# Altium project StigmatorDriver.PrjPcb
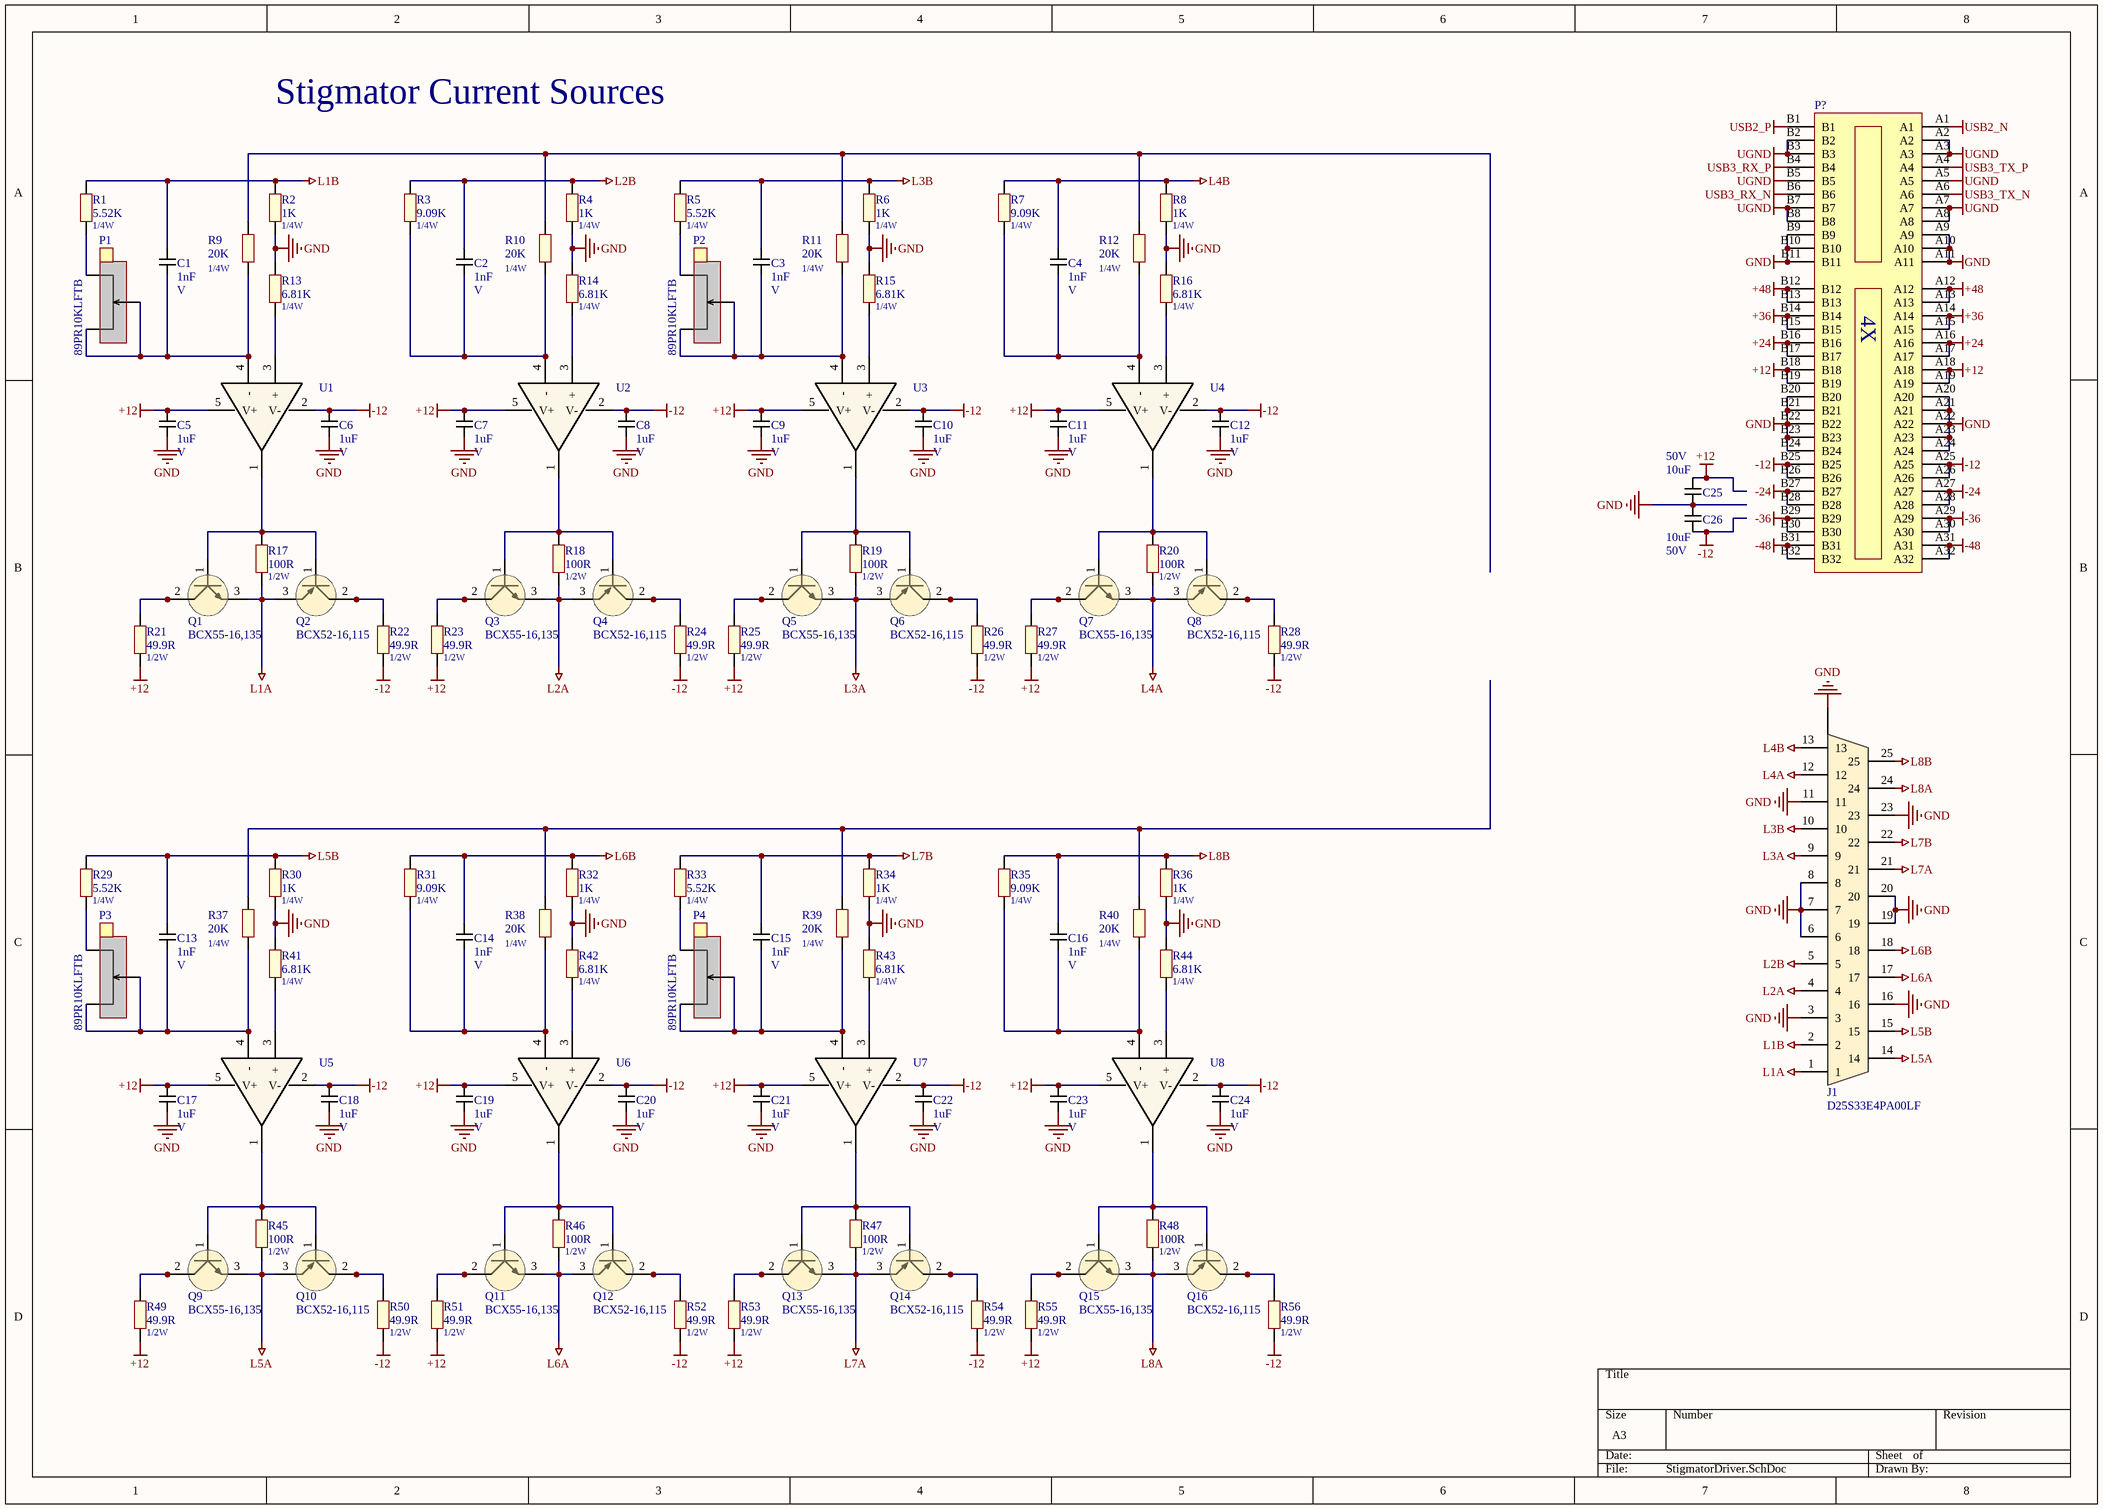
[diagram p0: StigmatorDriver.SchDoc]
1 sheet, 112 parts. Net scope: global (net labels, ports and power ports of the same name join across sheets).
Board file: SigmatorDriver.PcbDoc

## Sheet StigmatorDriver.SchDoc
size A3; SheetNumber: 1; SheetTotal: 1

### Parts
C1  1nF  Voltage: V  [C1206]
C2  1nF  Voltage: V  [C1206]
C3  1nF  Voltage: V  [C1206]
C4  1nF  Voltage: V  [C1206]
C5  1uF  Voltage: V  [C1206]
C6  1uF  Voltage: V  [C1206]
C7  1uF  Voltage: V  [C1206]
C8  1uF  Voltage: V  [C1206]
C9  1uF  Voltage: V  [C1206]
C10  1uF  Voltage: V  [C1206]
C11  1uF  Voltage: V  [C1206]
C12  1uF  Voltage: V  [C1206]
C13  1nF  Voltage: V  [C1206]
C14  1nF  Voltage: V  [C1206]
C15  1nF  Voltage: V  [C1206]
C16  1nF  Voltage: V  [C1206]
C17  1uF  Voltage: V  [C1206]
C18  1uF  Voltage: V  [C1206]
C19  1uF  Voltage: V  [C1206]
C20  1uF  Voltage: V  [C1206]
C21  1uF  Voltage: V  [C1206]
C22  1uF  Voltage: V  [C1206]
C23  1uF  Voltage: V  [C1206]
C24  1uF  Voltage: V  [C1206]
C25  10uF  Voltage: 50V  [C2220]
C26  10uF  Voltage: 50V  [C2220]
J1  D25S33E4PA00LF  [D25S33E4PA00LF]
P1  89PR10KLFTB  [89PR10KLFTB]
P2  89PR10KLFTB  [89PR10KLFTB]
P3  89PR10KLFTB  [89PR10KLFTB]
P4  89PR10KLFTB  [89PR10KLFTB]
P?  10018783-10201TLF  [PCIe4X]  (value not drawn)
Q1  BCX55-16,135  [SOT-89-3]
Q2  BCX52-16,115  [SOT-89-3]
Q3  BCX55-16,135  [SOT-89-3]
Q4  BCX52-16,115  [SOT-89-3]
Q5  BCX55-16,135  [SOT-89-3]
Q6  BCX52-16,115  [SOT-89-3]
Q7  BCX55-16,135  [SOT-89-3]
Q8  BCX52-16,115  [SOT-89-3]
Q9  BCX55-16,135  [SOT-89-3]
Q10  BCX52-16,115  [SOT-89-3]
Q11  BCX55-16,135  [SOT-89-3]
Q12  BCX52-16,115  [SOT-89-3]
Q13  BCX55-16,135  [SOT-89-3]
Q14  BCX52-16,115  [SOT-89-3]
Q15  BCX55-16,135  [SOT-89-3]
Q16  BCX52-16,115  [SOT-89-3]
R1  5.52K  Power: 1/4W  [R0805]
R2  1K  Power: 1/4W  [R0805]
R3  9.09K  Power: 1/4W  [R0805]
R4  1K  Power: 1/4W  [R0805]
R5  5.52K  Power: 1/4W  [R0805]
R6  1K  Power: 1/4W  [R0805]
R7  9.09K  Power: 1/4W  [R0805]
R8  1K  Power: 1/4W  [R0805]
R9  20K  Power: 1/4W  [R0805]
R10  20K  Power: 1/4W  [R0805]
R11  20K  Power: 1/4W  [R0805]
R12  20K  Power: 1/4W  [R0805]
R13  6.81K  Power: 1/4W  [R0805]
R14  6.81K  Power: 1/4W  [R0805]
R15  6.81K  Power: 1/4W  [R0805]
R16  6.81K  Power: 1/4W  [R0805]
R17  100R  Power: 1/2W  [R1206]
R18  100R  Power: 1/2W  [R1206]
R19  100R  Power: 1/2W  [R1206]
R20  100R  Power: 1/2W  [R1206]
R21  49.9R  Power: 1/2W  [R1206]
R22  49.9R  Power: 1/2W  [R1206]
R23  49.9R  Power: 1/2W  [R1206]
R24  49.9R  Power: 1/2W  [R1206]
R25  49.9R  Power: 1/2W  [R1206]
R26  49.9R  Power: 1/2W  [R1206]
R27  49.9R  Power: 1/2W  [R1206]
R28  49.9R  Power: 1/2W  [R1206]
R29  5.52K  Power: 1/4W  [R0805]
R30  1K  Power: 1/4W  [R0805]
R31  9.09K  Power: 1/4W  [R0805]
R32  1K  Power: 1/4W  [R0805]
R33  5.52K  Power: 1/4W  [R0805]
R34  1K  Power: 1/4W  [R0805]
R35  9.09K  Power: 1/4W  [R0805]
R36  1K  Power: 1/4W  [R0805]
R37  20K  Power: 1/4W  [R0805]
R38  20K  Power: 1/4W  [R0805]
R39  20K  Power: 1/4W  [R0805]
R40  20K  Power: 1/4W  [R0805]
R41  6.81K  Power: 1/4W  [R0805]
R42  6.81K  Power: 1/4W  [R0805]
R43  6.81K  Power: 1/4W  [R0805]
R44  6.81K  Power: 1/4W  [R0805]
R45  100R  Power: 1/2W  [R1206]
R46  100R  Power: 1/2W  [R1206]
R47  100R  Power: 1/2W  [R1206]
R48  100R  Power: 1/2W  [R1206]
R49  49.9R  Power: 1/2W  [R1206]
R50  49.9R  Power: 1/2W  [R1206]
R51  49.9R  Power: 1/2W  [R1206]
R52  49.9R  Power: 1/2W  [R1206]
R53  49.9R  Power: 1/2W  [R1206]
R54  49.9R  Power: 1/2W  [R1206]
R55  49.9R  Power: 1/2W  [R1206]
R56  49.9R  Power: 1/2W  [R1206]
U1  TLV9361IDBVR  [SOT-23-5]  (value not drawn)
U2  TLV9361IDBVR  [SOT-23-5]  (value not drawn)
U3  TLV9361IDBVR  [SOT-23-5]  (value not drawn)
U4  TLV9361IDBVR  [SOT-23-5]  (value not drawn)
U5  TLV9361IDBVR  [SOT-23-5]  (value not drawn)
U6  TLV9361IDBVR  [SOT-23-5]  (value not drawn)
U7  TLV9361IDBVR  [SOT-23-5]  (value not drawn)
U8  TLV9361IDBVR  [SOT-23-5]  (value not drawn)

### Nets
+12: C5.2 C7.2 C9.2 C11.2 C17.2 C19.2 C21.2 C23.2 C25.2 P?.A18 P?.A19 P?.B18 P?.B19 R21.2 R23.2 R25.2 R27.2 R49.2 R51.2 R53.2 R55.2 U1.5(V+) U2.5(V+) U3.5(V+) U4.5(V+) U5.5(V+) U6.5(V+) U7.5(V+) U8.5(V+)
+24: P?.A16 P?.A17 P?.B16 P?.B17
+36: P?.A14 P?.A15 P?.B14 P?.B15
+48: P?.A12 P?.A13 P?.B12 P?.B13
-12: C6.2 C8.2 C10.2 C12.2 C18.2 C20.2 C22.2 C24.2 C26.1 P?.A25 P?.A26 P?.B25 P?.B26 R22.1 R24.1 R26.1 R28.1 R50.1 R52.1 R54.1 R56.1 U1.2(V-) U2.2(V-) U3.2(V-) U4.2(V-) U5.2(V-) U6.2(V-) U7.2(V-) U8.2(V-)
-24: P?.A27 P?.A28 P?.B27 P?.B28
-36: P?.A29 P?.A30 P?.B29 P?.B30
-48: P?.A31 P?.A32 P?.B31 P?.B32
GND: C5.1 C6.1 C7.1 C8.1 C9.1 C10.1 C11.1 C12.1 C17.1 C18.1 C19.1 C20.1 C21.1 C22.1 C23.1 C24.1 C25.1 C26.2 J1.3 J1.6 J1.7 J1.8 J1.11 J1.16 J1.19 J1.20 J1.23 J1.S P?.A9 P?.A10 P?.A11 P?.A20 P?.A21 P?.A22 P?.A23 P?.A24 P?.B9 P?.B10 P?.B11 P?.B20 P?.B21 P?.B22 P?.B23 P?.B24 R2.1 R4.1 R6.1 R8.1 R13.2 R14.2 R15.2 R16.2 R30.1 R32.1 R34.1 R36.1 R41.2 R42.2 R43.2 R44.2
L1A: J1.1 Q1.3 Q2.3 R17.1
L1B: C1.2 J1.2 R1.2 R2.2
L2A: J1.4 Q3.3 Q4.3 R18.1
L2B: C2.2 J1.5 R3.2 R4.2
L3A: J1.9 Q5.3 Q6.3 R19.1
L3B: C3.2 J1.10 R5.2 R6.2
L4A: J1.12 Q7.3 Q8.3 R20.1
L4B: C4.2 J1.13 R7.2 R8.2
L5A: J1.14 Q9.3 Q10.3 R45.1
L5B: C13.2 J1.15 R29.2 R30.2
L6A: J1.17 Q11.3 Q12.3 R46.1
L6B: C14.2 J1.18 R31.2 R32.2
L7A: J1.21 Q13.3 Q14.3 R47.1
L7B: C15.2 J1.22 R33.2 R34.2
L8A: J1.24 Q15.3 Q16.3 R48.1
L8B: C16.2 J1.25 R35.2 R36.2
UGND: P?.A2 P?.A3 P?.A5 P?.A7 P?.A8 P?.B2 P?.B3 P?.B5 P?.B7 P?.B8
USB2_N: P?.A1
USB2_P: P?.B1
USB3_RX_N: P?.B6
USB3_RX_P: P?.B4
USB3_TX_N: P?.A6
USB3_TX_P: P?.A4
NetC1_1: C1.1 P1.1 P1.2 R9.1 U1.4(-)
NetC2_1: C2.1 R3.1 R10.1 U2.4(-)
NetC3_1: C3.1 P2.1 P2.2 R11.1 U3.4(-)
NetC4_1: C4.1 R7.1 R12.1 U4.4(-)
NetC13_1: C13.1 P3.1 P3.2 R37.1 U5.4(-)
NetC14_1: C14.1 R31.1 R38.1 U6.4(-)
NetC15_1: C15.1 P4.1 P4.2 R39.1 U7.4(-)
NetC16_1: C16.1 R35.1 R40.1 U8.4(-)
NetP1_3: P1.3 R1.1
NetP2_3: P2.3 R5.1
NetP3_3: P3.3 R29.1
NetP4_3: P4.3 R33.1
NetQ1_1: Q1.1 Q2.1 R17.2 U1.1
NetQ1_2: Q1.2 Q1.4 R21.1
NetQ2_2: Q2.2 Q2.4 R22.2
NetQ3_1: Q3.1 Q4.1 R18.2 U2.1
NetQ3_2: Q3.2 Q3.4 R23.1
NetQ4_2: Q4.2 Q4.4 R24.2
NetQ5_1: Q5.1 Q6.1 R19.2 U3.1
NetQ5_2: Q5.2 Q5.4 R25.1
NetQ6_2: Q6.2 Q6.4 R26.2
NetQ7_1: Q7.1 Q8.1 R20.2 U4.1
NetQ7_2: Q7.2 Q7.4 R27.1
NetQ8_2: Q8.2 Q8.4 R28.2
NetQ9_1: Q9.1 Q10.1 R45.2 U5.1
NetQ9_2: Q9.2 Q9.4 R49.1
NetQ10_2: Q10.2 Q10.4 R50.2
NetQ11_1: Q11.1 Q12.1 R46.2 U6.1
NetQ11_2: Q11.2 Q11.4 R51.1
NetQ12_2: Q12.2 Q12.4 R52.2
NetQ13_1: Q13.1 Q14.1 R47.2 U7.1
NetQ13_2: Q13.2 Q13.4 R53.1
NetQ14_2: Q14.2 Q14.4 R54.2
NetQ15_1: Q15.1 Q16.1 R48.2 U8.1
NetQ15_2: Q15.2 Q15.4 R55.1
NetQ16_2: Q16.2 Q16.4 R56.2
NetR9_2: R9.2 R10.2 R11.2 R12.2
NetR13_1: R13.1 U1.3(+)
NetR14_1: R14.1 U2.3(+)
NetR15_1: R15.1 U3.3(+)
NetR16_1: R16.1 U4.3(+)
NetR37_2: R37.2 R38.2 R39.2 R40.2
NetR41_1: R41.1 U5.3(+)
NetR42_1: R42.1 U6.3(+)
NetR43_1: R43.1 U7.3(+)
NetR44_1: R44.1 U8.3(+)

### Notes on the sheet
- Stigmator Current Sources
- (in symbol 10018783-10201TLF) 4X

### Library data of the parts
C1-C24 = C1206: Capacitor 1206
  C1-C4 C13-C16: Capacitance: 1nF
  C5-C12 C17-C24: Capacitance: 1uF
C25 C26 = C2220: Capacitor 2220; Capacitance: 10uF
J1 = DB-25: Supplier 1: Digi-Key; Supplier Part Number 1: 609-5879-ND
P? = 10018783-10201TLF: PCIe 4x; Supplier 1: Digi-Key; Supplier Part Number 1: 609-1964-ND
Q1 Q3 Q5 Q7 Q9 Q11 Q13 Q15 = BCX55-16,135: NPN 1A 60V 1.25W 180MHz; Supplier 1: Digi-Key; Supplier Part Number 1: 1727-1964-1-ND
Q2 Q4 Q6 Q8 Q10 Q12 Q14 Q16 = BCX52-16,115: PNP 1A 60V 1.3W 145MHz; Supplier 1: Digi-Key; Supplier Part Number 1: 1727-6209-1-ND
R1-R16 R29-R44 = R0.25W: Resistor 1/2W
  R1 R5 R29 R33: Resistance: 5.52K
  R2 R4 R6 R8 R30 R32 R34 R36: Resistance: 1K
  R3 R7 R31 R35: Resistance: 9.09K
  R9-R12 R37-R40: Resistance: 20K
  R13-R16 R41-R44: Resistance: 6.81K
R17-R28 R45-R56 = R0.5W: Resistor 1/2W
  R17-R20 R45-R48: Resistance: 100R
  R21-R28 R49-R56: Resistance: 49.9R
P1-P4 = 89PR10KLFTB: Supplier 1: Digi-Key; Supplier 2: Mouser; Supplier Part Number 1: 987-1801-5-ND; Supplier Part Number 2: 858-89PR10KLFTB